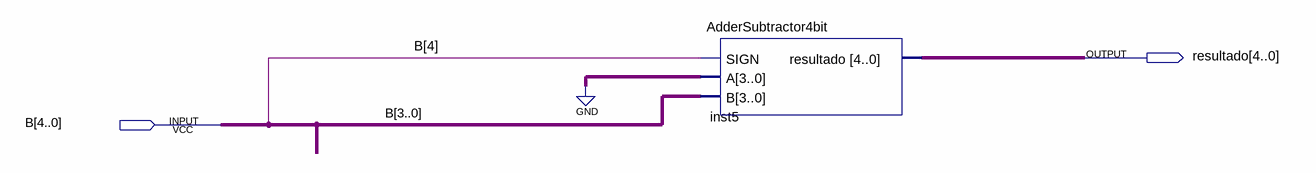
[diagram p0: schematic sheet]
// Quartus schematic CompOP.bdf as structural Verilog: 1 symbols, 2 pins
module CompOP (
  input  [4:0] B,
  output [4:0] resultado
);

  AdderSubtractor4bit inst5 (.SIGN(B[4]), .A(4'b0000), .B(B[3:0]), .resultado(resultado));
endmodule
